# Altium schematic sheet PSDT Power v1.0.0.SchDoc: Probe-Scope Digital Test: Power
size Letter; CompanyName: Probe-Scope; Organization: Probe-Scope; Address1: Probe-Scope: Unified USB; Address2: Oscilloscope Probe; Address3: ©2019 M. Omo, J. Rowley,; Address4: K. Hall, released under the; DocumentNumber: SCH0020; SheetNumber: 4; PageSetup: Record=PageOptions|CenterHorizontal=True|CenterVertical=True|PrintScale=0.96|XCorrection=1.00|YCorrection=1.00|PrintKind=1|BorderSize=5000000|LeftOffset=0|BottomOffset=0|Orientation=2|PaperLength=1000|PaperWidth=1000|Scale=100|PaperSource=7|PrintQuality=-4|MediaType=1|DitherType=10|PaperKind=11x17|PrintScaleMode=1; Assembly: ASP0020; License: CERN OHL v1.2
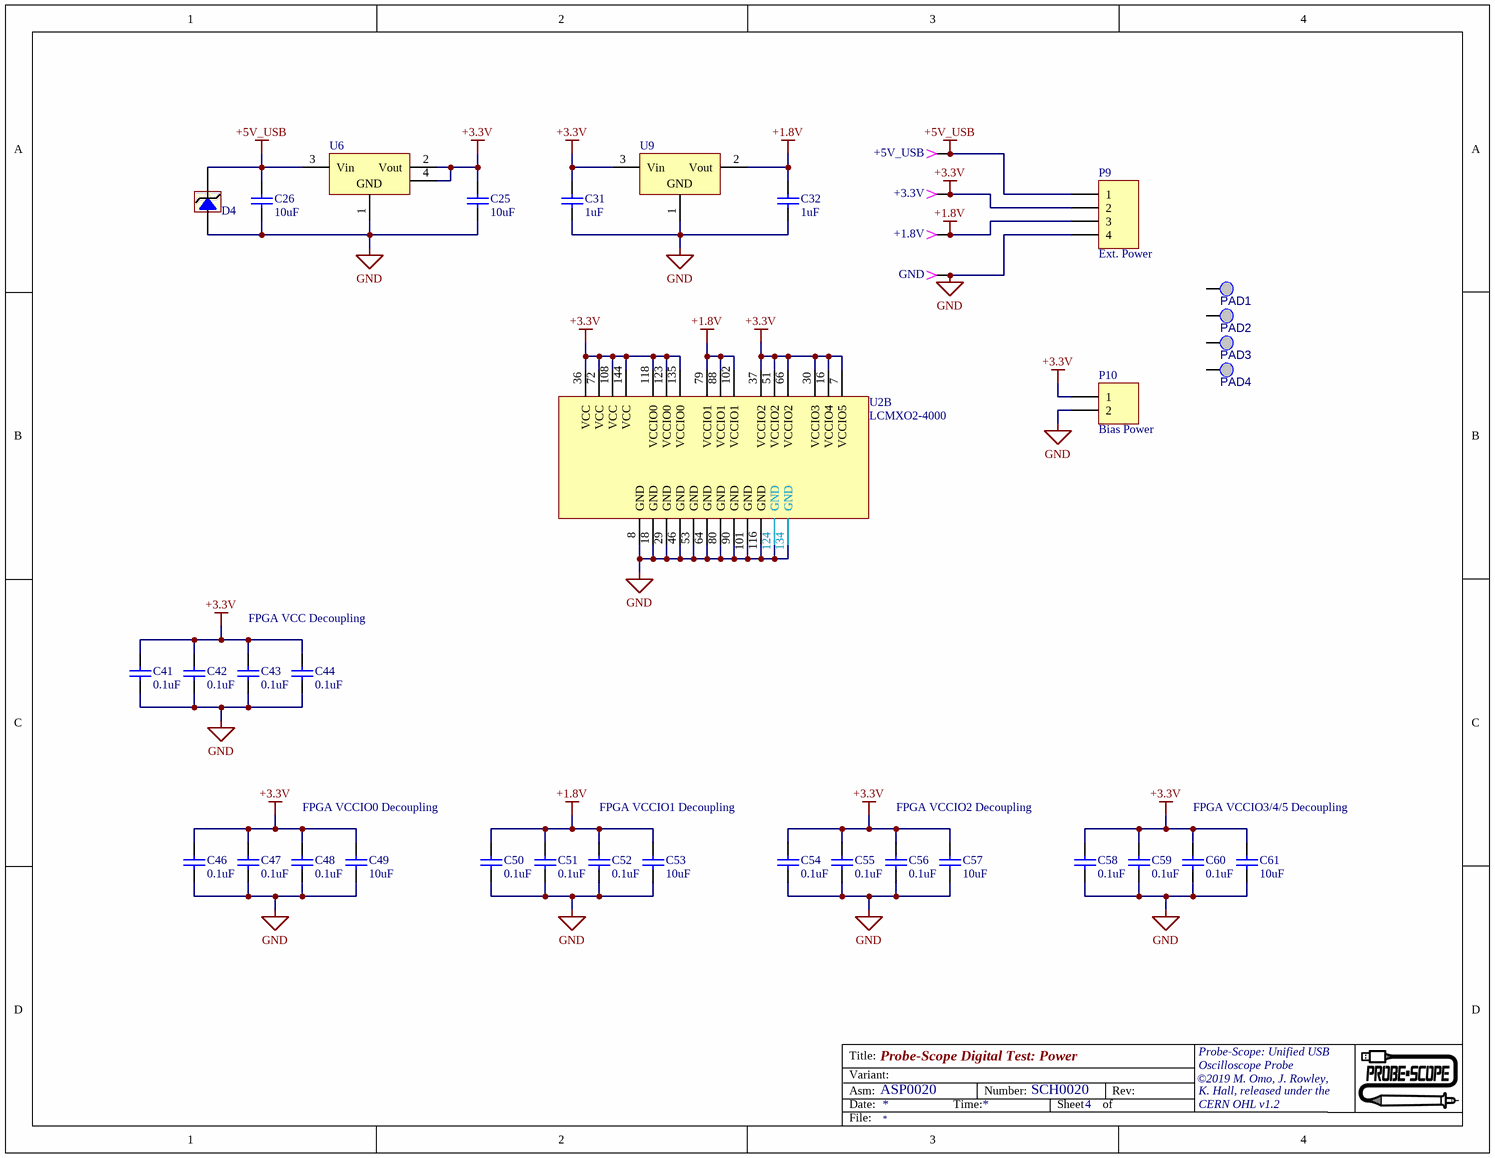
[diagram p0: PSDT Power v1.0.0.SchDoc]

## Parts
+1.8V  TP  [TESTPOINT024]  (value not drawn)
+3.3V  TP  [TESTPOINT024]  (value not drawn)
+5V_USB  TP  [TESTPOINT024]  (value not drawn)
C25  value 10uF  [0603(1608)]  (hidden comment: 25V)
C26  value 10uF  [0603(1608)]  (hidden comment: 25V)
C31  value 1uF  [0402(1005)]  (hidden comment: 10V)
C32  value 1uF  [0402(1005)]  (hidden comment: 10V)
C41  value 0.1uF  [0402(1005)]  (hidden comment: 6.3V)
C42  value 0.1uF  [0402(1005)]  (hidden comment: 6.3V)
C43  value 0.1uF  [0402(1005)]  (hidden comment: 6.3V)
C44  value 0.1uF  [0402(1005)]  (hidden comment: 6.3V)
C46  value 0.1uF  [0402(1005)]  (hidden comment: 6.3V)
C47  value 0.1uF  [0402(1005)]  (hidden comment: 6.3V)
C48  value 0.1uF  [0402(1005)]  (hidden comment: 6.3V)
C49  value 10uF  [0603(1608)]  (hidden comment: 25V)
C50  value 0.1uF  [0402(1005)]  (hidden comment: 6.3V)
C51  value 0.1uF  [0402(1005)]  (hidden comment: 6.3V)
C52  value 0.1uF  [0402(1005)]  (hidden comment: 6.3V)
C53  value 10uF  [0603(1608)]  (hidden comment: 25V)
C54  value 0.1uF  [0402(1005)]  (hidden comment: 6.3V)
C55  value 0.1uF  [0402(1005)]  (hidden comment: 6.3V)
C56  value 0.1uF  [0402(1005)]  (hidden comment: 6.3V)
C57  value 10uF  [0603(1608)]  (hidden comment: 25V)
C58  value 0.1uF  [0402(1005)]  (hidden comment: 6.3V)
C59  value 0.1uF  [0402(1005)]  (hidden comment: 6.3V)
C60  value 0.1uF  [0402(1005)]  (hidden comment: 6.3V)
C61  value 10uF  [0603(1608)]  (hidden comment: 25V)
D4  6.5V  [SMB NP]  (value not drawn)
GND  TP  [TESTPOINT024]  (value not drawn)
P9  Ext. Power  [0.1HDR1X4P]
P10  Bias Power  [0.1HDR1X2P]
PAD1  4-40 Loose  [PAD-4-40 Loose]  (value not drawn)  (no BOM)
PAD2  4-40 Loose  [PAD-4-40 Loose]  (value not drawn)  (no BOM)
PAD3  4-40 Loose  [PAD-4-40 Loose]  (value not drawn)  (no BOM)
PAD4  4-40 Loose  [PAD-4-40 Loose]  (value not drawn)  (no BOM)
U2  LCMXO2-4000  [UL_TQFP144]  (part B of 5)
U6  LD1086D2M33TR  [D2PAK TO263-4N]  (value not drawn)
U9  1.8V  [SOT23-12-3TOP]  (value not drawn)

## Nets
+1.8V: +1.8V.1 C32.2 C50.2 C51.2 C52.2 C53.2 P9.3 U2.79(VCCIO1) U2.88(VCCIO1) U2.102(VCCIO1) U9.2(Vout)
+3.3V: +3.3V.1 C25.2 C31.2 C41.2 C42.2 C43.2 C44.2 C46.2 C47.2 C48.2 C49.2 C54.2 C55.2 C56.2 C57.2 C58.2 C59.2 C60.2 C61.2 P9.2 P10.1 U2.7(VCCIO5) U2.16(VCCIO4) U2.30(VCCIO3) U2.36(VCC) U2.37(VCCIO2) U2.51(VCCIO2) U2.66(VCCIO2) U2.72(VCC) U2.108(VCC) U2.118(VCCIO0) U2.123(VCCIO0) U2.135(VCCIO0) U2.144(VCC) U6.2(Vout) U6.4(GND) U9.3(Vin)
+5V_USB: +5V_USB.1 C26.2 D4.2 P9.1 U6.3(Vin)
GND: C25.1 C26.1 C31.1 C32.1 C41.1 C42.1 C43.1 C44.1 C46.1 C47.1 C48.1 C49.1 C50.1 C51.1 C52.1 C53.1 C54.1 C55.1 C56.1 C57.1 C58.1 C59.1 C60.1 C61.1 D4.1 GND.1 P9.4 P10.2 U2.8(GND) U2.18(GND) U2.29(GND) U2.46(GND) U2.53(GND) U2.64(GND) U2.80(GND) U2.90(GND) U2.101(GND) U2.116(GND) U2.124(GND) U2.134(GND) U6.1(GND) U9.1(GND)

Not connected (* = marked no-connect by the designer): PAD1 1; PAD2 1; PAD3 1; PAD4 1

## Notes on the sheet
- FPGA VCC Decoupling
- FPGA VCCIO0 Decoupling
- FPGA VCCIO1 Decoupling
- FPGA VCCIO2 Decoupling
- FPGA VCCIO3/4/5 Decoupling
- Title:
- Asm:
- Date:
- Variant:
- Time:
- Number:
- Sheet
- of
- Rev:
- File:

## Library data of the parts
+1.8V +3.3V +5V_USB GND = 49: Key: 49; MENG_PN: CON00002; MANF: Keystone Electronics; MANF_PN: 1998-3; VENDOR: Digikey; VENDOR_PN: 1998-3K-ND; P&V Description: Connector, Test Point, 1 Positions, Male, Small, 0.27" Straight Pin, 0.02" dia; Class: Connector; Other: Small, 0.27" Straight Pin, 0.02" dia; Approved: True; Positions: 1; Sex: Male; Type: Test Point; SMD: False; Date Modified: 9/30/2014 10:31:54 AM; Parent Key: 49; Verified: True; Modified By: sotterbacher
C25 C26 C49 C53 C57 C61 = 1306: Key: 1306; MENG_PN: ???1306; MANF: Samsung Electro-Mechanics; MANF_PN: CL10A106MA8NRNC; VENDOR: Digikey; VENDOR_PN: 1276-1869-1-ND; P&V Description: Capacitor, Ceramic, 10uF, 25V, 20% Tol, 85C, X5R, 0603, SMD; Class: Capacitor; Type: Ceramic; Other: X5R; Tolerance: 20; Voltage: 25; Max Temperature: 85; Approved: True; Package: 0603; SMD: True; Date Modified: 3/3/2015 11:08:29 AM; Modified By: sotterbacher; Parent Key: 1306; Verified: True
C31 C32 = 1876: Key: 1876; MENG_PN: ???1876; MANF: Murata Electronics; MANF_PN: GCM155C71A105KE38D; VENDOR: Digikey; VENDOR_PN: 490-13409-1-ND; P&V Description: Capacitor, Ceramic, 1uF, 10V, 10% Tol, 125C, X7S, 0402, SMD; Class: Capacitor; Type: Ceramic; Other: X7S; Tolerance: 10; Max Temperature: 125; Approved: False; Package: 0402; SMD: True; Date Modified: 11/6/2018 11:19:13 AM; Modified By: jrowley; Voltage: 10; Parent Key: 1876; Verified: False
C41-C44 C46-C48 C50-C52 C54-C56 C58-C60 = 1875: Key: 1875; MENG_PN: ???1875; MANF: Samsung Electro-Mechanics; MANF_PN: CL05B104KQ5NNNC; VENDOR: Digikey; VENDOR_PN: 1276-1511-1-ND; P&V Description: Capacitor, Ceramic, 0.1uF, 6.3V, 10% Tol, 125C, X7R, 0402, SMD; Class: Capacitor; Type: Ceramic; Other: X7R; Tolerance: 10; Voltage: 6.3; Max Temperature: 125; Approved: False; Package: 0402; SMD: True; Date Modified: 11/6/2018 11:14:02 AM; Modified By: jrowley; Parent Key: 1875; Verified: False
D4 = 1447: Key: 1447; MENG_PN: ???1447; MANF: Littelfuse; MANF_PN: SMBJ6.5A; VENDOR: Digikey; VENDOR_PN: SMBJ6.5ALFCT-ND; P&V Description: Diode, Transzorb, 6.5V, 53.6A, 600W, V breakdoen min 7.22V, Voltage Clamping Max 11.2V, Unidirectional Zener Clamp, TVS, Circuit Protection, SMB, SMD; Class: Diode; Other: V breakdoen min 7.22V, Voltage Clamping Max 11.2V, Unidirectional Zener Clamp, TVS, Circuit Protection; Voltage: 6.5; Current: 53.6; Power: 600; Approved: True; Type: Transzorb; Package: SMB; SMD: True; Date Modified: 4/13/2016 2:45:26 PM; Modified By: tgage; Parent Key: 1447; Verified: True
P9 = 163: Key: 163; MENG_PN: CON00029; MANF: Molex; VENDOR: Digikey; VENDOR_PN: WM2702-ND; P&V Description: Connector, Header, 0.1", 4 Positions, Male, 0.1" Spacing, 4A, 250V, 0.24" Long, 0.125" Tail, 15u" Select Gold, Polarized, Locking Ramp, Vert; Class: Connector; Other: 0.24" Long, 0.125" Tail, 15u" Select Gold, Polarized, Locking Ramp, Vert; Current: 4; Voltage: 250; Spacing: 0.1; Sex: Male; Approved: False; MANF_PN: 22-11-2042; Type: Header, 0.1"; SMD: False; Date Modified: 7/21/2017 2:27:52 PM; Modified By: jrowley; Positions: 4; Parent Key: 163; Verified: False
P10 = 375: Key: 375; MENG_PN: CON00068; MANF: Molex; VENDOR: Digikey; VENDOR_PN: WM2700-ND; P&V Description: Connector, Header, 0.1", 2 Positions, Male, 0.1" Spacing, 4A, 250V, 0.24" Long, 0.125" Tail, 15u Select Gold, Polarized, Locking Ramp; Class: Connector; Other: 0.24" Long, 0.125" Tail, 15u Select Gold, Polarized, Locking Ramp; Current: 4; Voltage: 250; Positions: 2; Spacing: 0.1; Sex: Male; Approved: False; MANF_PN: 22-11-2022; Type: Header, 0.1"; SMD: False; Date Modified: 7/21/2017 2:28:28 PM; Modified By: jrowley; Parent Key: 375; Verified: False
PAD1-PAD4 = 671: Key: 671; MENG_PN: ???671; MANF: dummy; MANF_PN: 000-671; P&V Description: Fabrication, Hole, 4-40 Pad, Loose Fit, Not a Part; Class: Fabrication; Other: 4-40 Pad, Loose Fit, Not a Part; Approved: True; VENDOR: dummy; Type: Hole; SMD: False; Date Modified: 11/19/2010 2:33:14 PM; Modified By: pmarcus; Parent Key: 671; Verified: True
U2 = MachXO2-4000-TG144: MANF: Lattice Semiconductor Corporation; MANF_PN: LCMXO2-4000HC-4TG144C; VENDOR: DigiKey; VENDOR_PN: 220-1460-ND
U6 = 690: Key: 690; MENG_PN: ANG00046; MANF: ST Microelectronics; VENDOR: Digikey; VENDOR_PN: 497-1223-1-ND; P&V Description: IC, Voltage Regulator, 3.3V, 1.5A max Iout, 30V Max Vin, DPAK-3, SMD; Class: IC; Other: 3.3V, 1.5A max Iout, 30V Max Vin; Approved: True; MANF_PN: LD1086D2M33TR; Type: Voltage Regulator; Package: DPAK-3; SMD: True; Date Modified: 4/8/2011 3:28:12 PM; Modified By: cschneiker; Parent Key: 690; Verified: True
U9 = 2073: Key: 2073; MENG_PN: ???2073; MANF: Microchip; MANF_PN: MCP1703T-1802E/CB; VENDOR: Digikey; VENDOR_PN: MCP1703T-1802E/CBCT-ND; P&V Description: IC, Voltage Regulator, 1.8Vout, 2.7-16Vin, 200mA, -40°C ~ 125°C, SOT-23, SMD; Class: IC; Other: 1.8Vout, 2.7-16Vin, 200mA, -40°C ~ 125°C; Approved: False; Type: Voltage Regulator; Package: SOT-23; SMD: True; Date Modified: 6/21/2019 8:23:33 PM; Modified By: jrowley; Parent Key: 2073; Verified: False